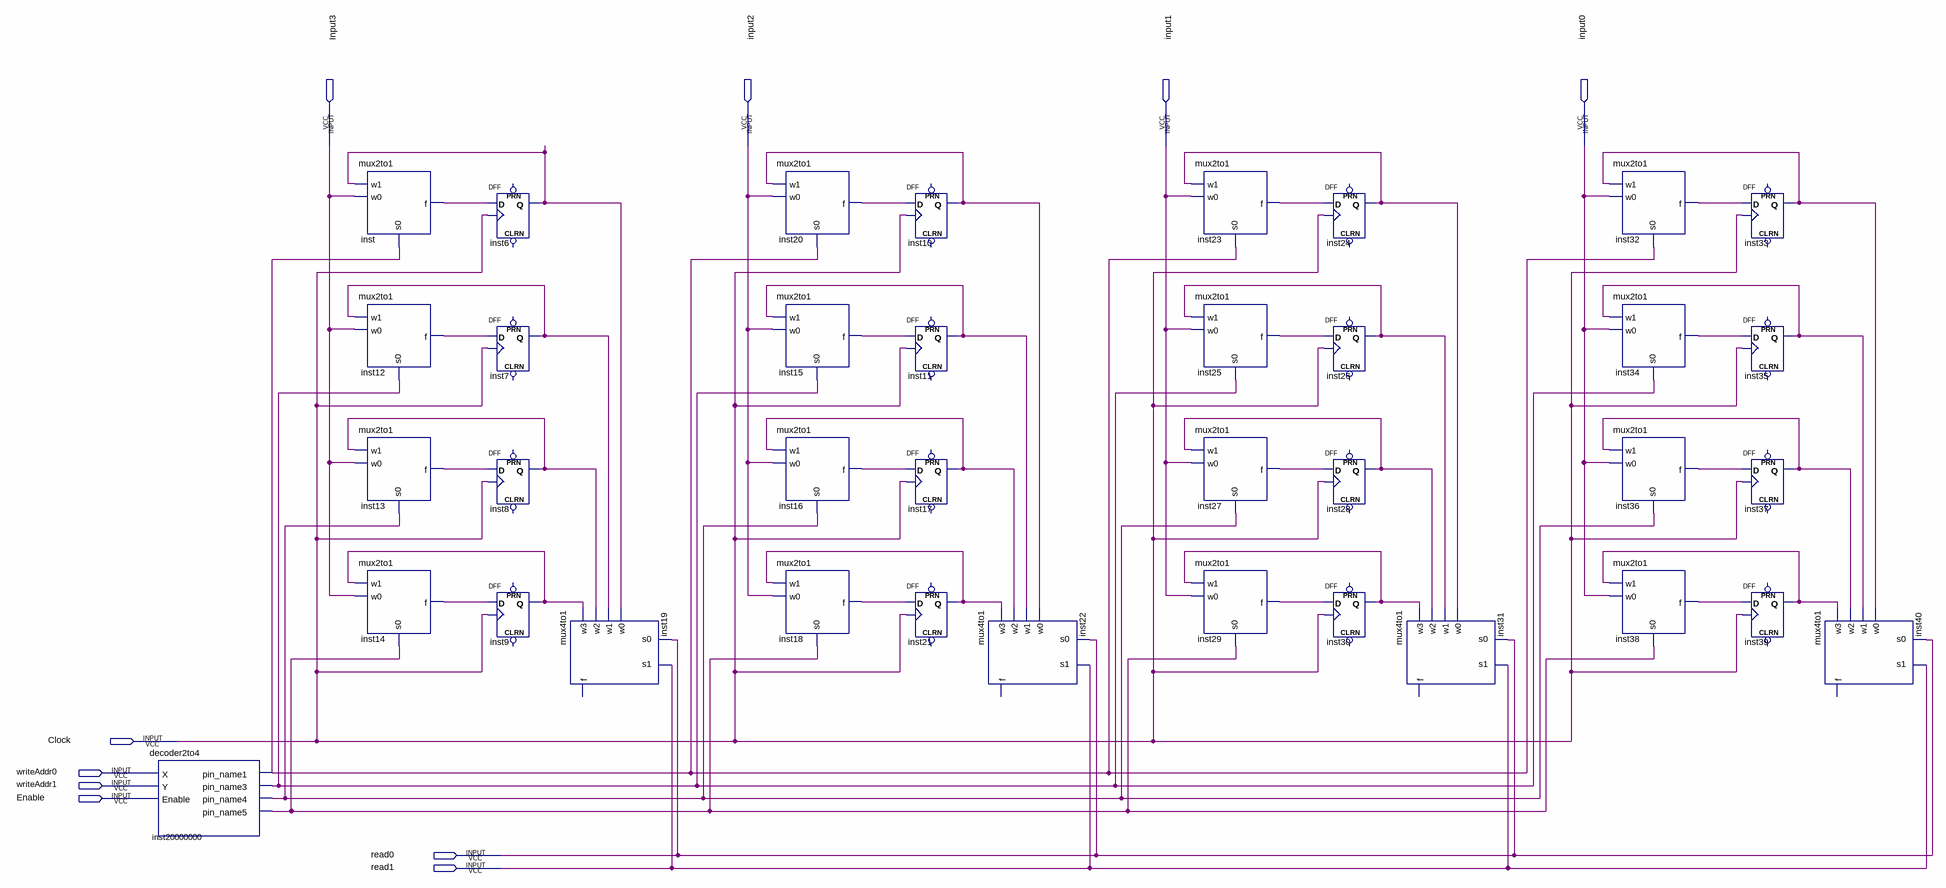
[diagram p0: schematic sheet]
// Quartus schematic register.bdf as structural Verilog: 37 symbols, 10 pins
module register (
  input  Input3,
  input  input2,
  input  input1,
  input  input0,
  input  Clock,
  input  writeAddr0,
  input  writeAddr1,
  input  Enable,
  input  read0,
  input  read1
);

  wire inst6_q, inst7_q, inst8_q, inst9_q, inst10_q, inst11_q, inst12_f, inst13_f, inst14_f, inst15_f,
       inst16_f, inst17_q, inst18_f, inst20_f, inst21_q, inst23_f, inst24_q, inst25_f, inst26_q, inst27_f,
       inst28_q, inst29_f, inst30_q, inst32_f, inst33_q, inst34_f, inst35_q, inst36_f, inst37_q, inst38_f,
       inst39_q, inst20000000_pin_name1, inst20000000_pin_name3, inst20000000_pin_name4,
       inst20000000_pin_name5, inst_f;

  decoder2to4 inst20000000 (
    .X(writeAddr0), .Y(writeAddr1), .Enable(Enable), .pin_name1(inst20000000_pin_name1),
    .pin_name3(inst20000000_pin_name3), .pin_name4(inst20000000_pin_name4), .pin_name5(inst20000000_pin_name5));
  mux2to1 inst (.w1(inst6_q), .w0(Input3), .s0(inst20000000_pin_name1), .f(inst_f));
  mux2to1 inst12 (.w1(inst7_q), .w0(Input3), .s0(inst20000000_pin_name3), .f(inst12_f));
  mux2to1 inst13 (.w1(inst8_q), .w0(Input3), .s0(inst20000000_pin_name4), .f(inst13_f));
  mux2to1 inst14 (.w1(inst9_q), .w0(Input3), .s0(inst20000000_pin_name5), .f(inst14_f));
  DFF inst6 (.CLK(Clock), .D(inst_f), .Q(inst6_q));  // open: CLRN, PRN
  DFF inst7 (.CLK(Clock), .D(inst12_f), .Q(inst7_q));  // open: CLRN, PRN
  DFF inst8 (.CLK(Clock), .D(inst13_f), .Q(inst8_q));  // open: CLRN, PRN
  DFF inst9 (.CLK(Clock), .D(inst14_f), .Q(inst9_q));  // open: CLRN, PRN
  mux4to1 inst19 (.w3(inst9_q), .w2(inst8_q), .w1(inst7_q), .w0(inst6_q), .s1(read1), .s0(read0));  // open: f
  mux2to1 inst20 (.w1(inst10_q), .w0(input2), .s0(inst20000000_pin_name1), .f(inst20_f));
  mux2to1 inst15 (.w1(inst11_q), .w0(input2), .s0(inst20000000_pin_name3), .f(inst15_f));
  mux2to1 inst16 (.w1(inst17_q), .w0(input2), .s0(inst20000000_pin_name4), .f(inst16_f));
  mux2to1 inst18 (.w1(inst21_q), .w0(input2), .s0(inst20000000_pin_name5), .f(inst18_f));
  DFF inst10 (.CLK(Clock), .D(inst20_f), .Q(inst10_q));  // open: CLRN, PRN
  DFF inst11 (.CLK(Clock), .D(inst15_f), .Q(inst11_q));  // open: CLRN, PRN
  DFF inst17 (.CLK(Clock), .D(inst16_f), .Q(inst17_q));  // open: CLRN, PRN
  DFF inst21 (.CLK(Clock), .D(inst18_f), .Q(inst21_q));  // open: CLRN, PRN
  mux4to1 inst22 (.w3(inst21_q), .w2(inst17_q), .w1(inst11_q), .w0(inst10_q), .s1(read1), .s0(read0));  // open: f
  mux2to1 inst23 (.w1(inst24_q), .w0(input1), .s0(inst20000000_pin_name1), .f(inst23_f));
  mux2to1 inst25 (.w1(inst26_q), .w0(input1), .s0(inst20000000_pin_name3), .f(inst25_f));
  mux2to1 inst27 (.w1(inst28_q), .w0(input1), .s0(inst20000000_pin_name4), .f(inst27_f));
  mux2to1 inst29 (.w1(inst30_q), .w0(input1), .s0(inst20000000_pin_name5), .f(inst29_f));
  DFF inst24 (.CLK(Clock), .D(inst23_f), .Q(inst24_q));  // open: CLRN, PRN
  DFF inst26 (.CLK(Clock), .D(inst25_f), .Q(inst26_q));  // open: CLRN, PRN
  DFF inst28 (.CLK(Clock), .D(inst27_f), .Q(inst28_q));  // open: CLRN, PRN
  DFF inst30 (.CLK(Clock), .D(inst29_f), .Q(inst30_q));  // open: CLRN, PRN
  mux4to1 inst31 (.w3(inst30_q), .w2(inst28_q), .w1(inst26_q), .w0(inst24_q), .s1(read1), .s0(read0));  // open: f
  mux2to1 inst32 (.w1(inst33_q), .w0(input0), .s0(inst20000000_pin_name1), .f(inst32_f));
  mux2to1 inst34 (.w1(inst35_q), .w0(input0), .s0(inst20000000_pin_name3), .f(inst34_f));
  mux2to1 inst36 (.w1(inst37_q), .w0(input0), .s0(inst20000000_pin_name4), .f(inst36_f));
  mux2to1 inst38 (.w1(inst39_q), .w0(input0), .s0(inst20000000_pin_name5), .f(inst38_f));
  DFF inst33 (.CLK(Clock), .D(inst32_f), .Q(inst33_q));  // open: CLRN, PRN
  DFF inst35 (.CLK(Clock), .D(inst34_f), .Q(inst35_q));  // open: CLRN, PRN
  DFF inst37 (.CLK(Clock), .D(inst36_f), .Q(inst37_q));  // open: CLRN, PRN
  DFF inst39 (.CLK(Clock), .D(inst38_f), .Q(inst39_q));  // open: CLRN, PRN
  mux4to1 inst40 (.w3(inst39_q), .w2(inst37_q), .w1(inst35_q), .w0(inst33_q), .s1(read1), .s0(read0));  // open: f
endmodule
